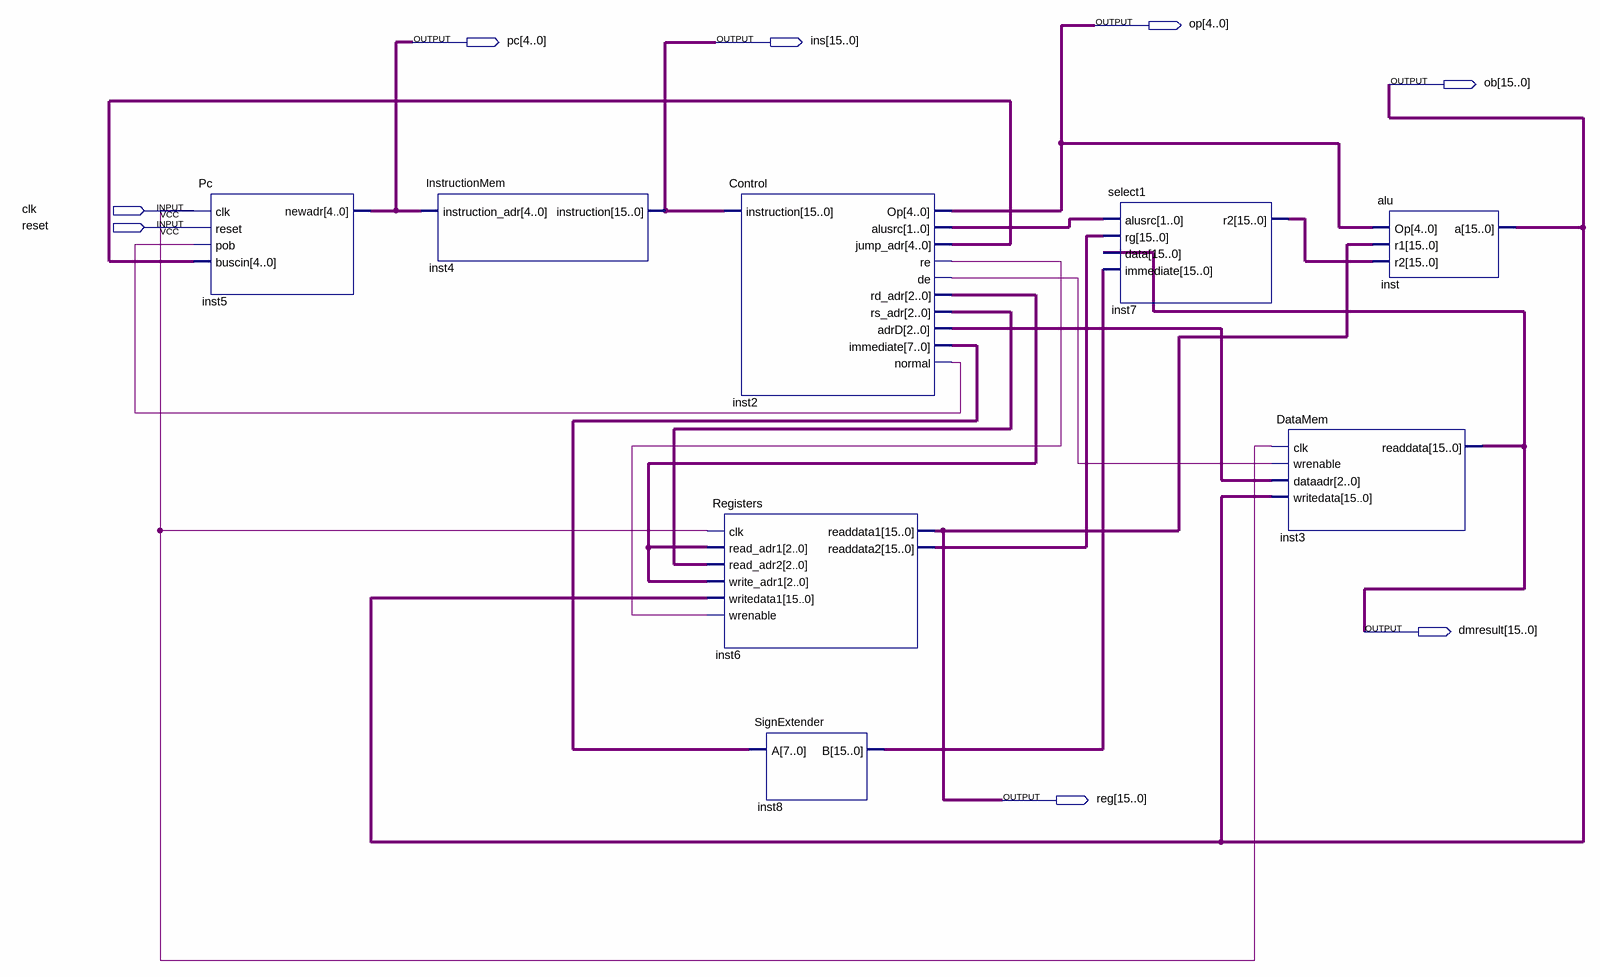
[diagram p0: schematic sheet]
// Quartus schematic cpu16.bdf as structural Verilog: 8 symbols, 8 pins
module cpu16 (
  input  clk,
  input  reset,
  output [4:0] op,
  output [4:0] pc,
  output [15:0] ins,
  output [15:0] ob,
  output [15:0] dmresult,
  output [15:0] \reg 
);

  wire inst2_de, inst2_normal, inst2_re;
  wire [1:0] inst2_alusrc;
  wire [2:0] inst2_adrd, inst2_rd_adr, inst2_rs_adr;
  wire [4:0] inst2_jump_adr;
  wire [7:0] inst2_immediate;
  wire [15:0] inst6_readdata2, inst7_r2, inst8_b;

  Pc inst5 (.clk(clk), .reset(reset), .pob(inst2_normal), .buscin(inst2_jump_adr), .newadr(pc));
  InstructionMem inst4 (.instruction_adr(pc), .instruction(ins));
  Control inst2 (
    .instruction(ins), .Op(op), .alusrc(inst2_alusrc), .jump_adr(inst2_jump_adr), .re(inst2_re),
    .de(inst2_de), .rd_adr(inst2_rd_adr), .rs_adr(inst2_rs_adr), .adrD(inst2_adrd),
    .immediate(inst2_immediate), .normal(inst2_normal));
  Registers inst6 (
    .clk(clk), .read_adr1(inst2_rd_adr), .read_adr2(inst2_rs_adr), .write_adr1(inst2_rd_adr),
    .writedata1(ob), .wrenable(inst2_re), .readdata1(\reg ), .readdata2(inst6_readdata2));
  SignExtender inst8 (.A(inst2_immediate), .B(inst8_b));
  select1 inst7 (.alusrc(inst2_alusrc), .rg(inst6_readdata2), .data(dmresult), .immediate(inst8_b), .r2(inst7_r2));
  DataMem inst3 (.clk(clk), .wrenable(inst2_de), .dataadr(inst2_adrd), .writedata(ob), .readdata(dmresult));
  alu inst (.Op(op), .r1(\reg ), .r2(inst7_r2), .a(ob));
endmodule
